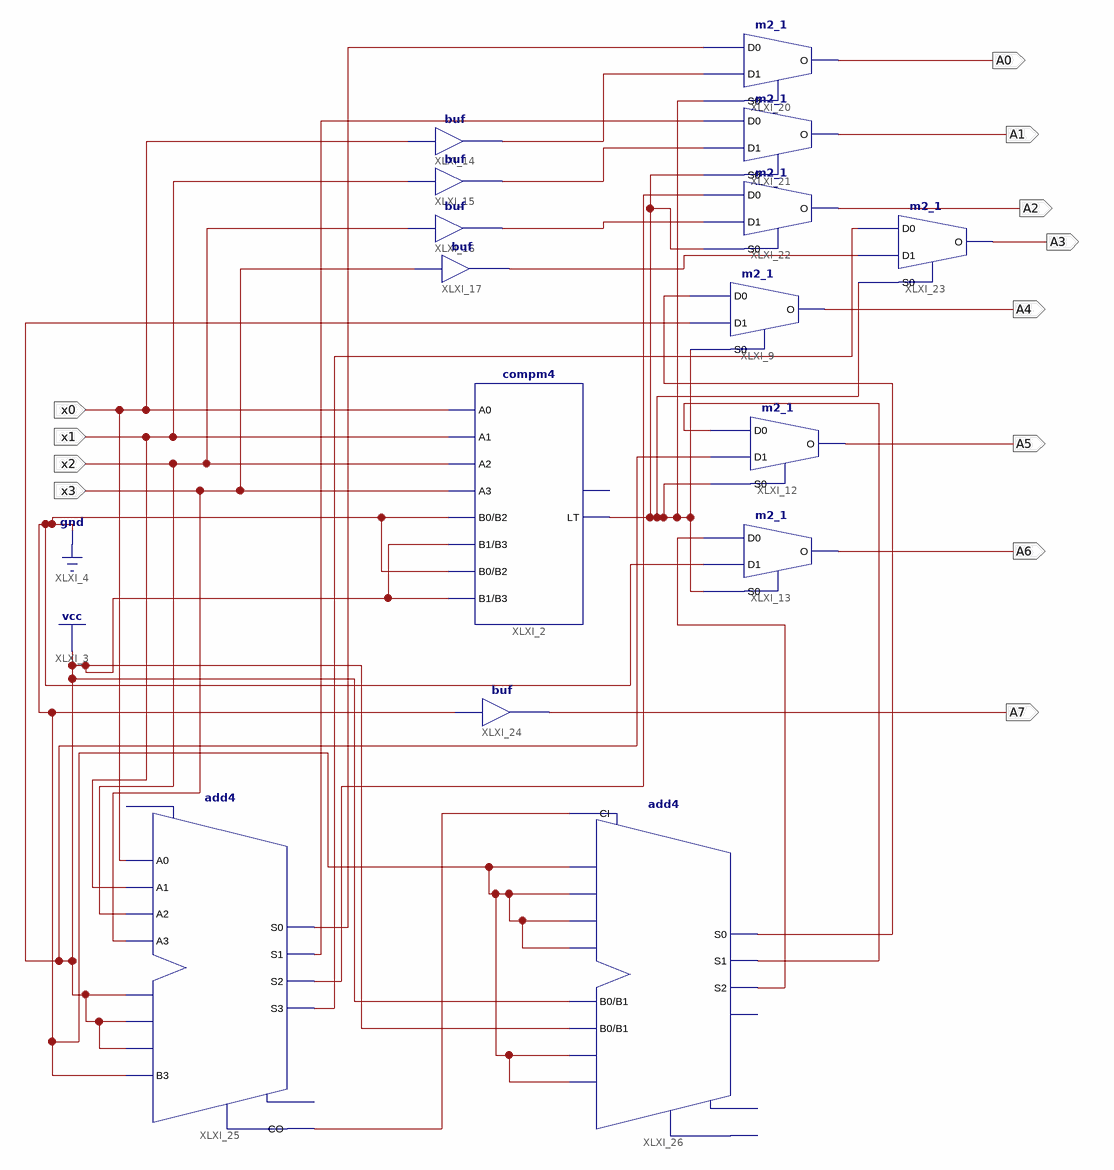
[diagram p0: schematic sheet 1]
// Xilinx ISE schematic hex_ascii_schem.sch (artix7) as structural Verilog: 15 symbols, 12 ports
module hex_ascii_schem (
  input  x3,
  input  x1,
  input  x2,
  input  x0,
  output A4,
  output A5,
  output A6,
  output A0,
  output A1,
  output A2,
  output A3,
  output A7
);

  wire XLXN_65, XLXN_66, XLXN_67, XLXN_68, XLXN_72, XLXN_84, XLXN_85, XLXN_86, XLXN_87, XLXN_88, XLXN_94,
       XLXN_95, XLXN_96;

  compm4 XLXI_2 (
    .A0(x0), .A1(x1), .A2(x2), .A3(x3), .B0(1'b0), .B1(1'b1), .B2(1'b0), .B3(1'b1), .LT(XLXN_65));  // open: GT
  m2_1 XLXI_9 (.D0(XLXN_94), .D1(1'b1), .S0(XLXN_65), .O(A4));
  m2_1 XLXI_12 (.D0(XLXN_95), .D1(1'b1), .S0(XLXN_65), .O(A5));
  m2_1 XLXI_13 (.D0(XLXN_96), .D1(1'b0), .S0(XLXN_65), .O(A6));
  buf XLXI_14 (XLXN_66, x0);
  buf XLXI_15 (XLXN_67, x1);
  buf XLXI_16 (XLXN_68, x2);
  buf XLXI_17 (XLXN_72, x3);
  m2_1 XLXI_20 (.D0(XLXN_84), .D1(XLXN_66), .S0(XLXN_65), .O(A0));
  m2_1 XLXI_21 (.D0(XLXN_85), .D1(XLXN_67), .S0(XLXN_65), .O(A1));
  m2_1 XLXI_22 (.D0(XLXN_86), .D1(XLXN_68), .S0(XLXN_65), .O(A2));
  m2_1 XLXI_23 (.D0(XLXN_87), .D1(XLXN_72), .S0(XLXN_65), .O(A3));
  buf XLXI_24 (A7, 1'b0);
  add4 XLXI_25 (
    .A0(x0), .A1(x1), .A2(x2), .A3(x3), .B0(1'b1), .B1(1'b1), .B2(1'b1), .B3(1'b0), .CO(XLXN_88),
    .S0(XLXN_84), .S1(XLXN_85), .S2(XLXN_86), .S3(XLXN_87));  // open: CI, OFL
  add4 XLXI_26 (
    .A0(1'b0), .A1(1'b0), .A2(1'b0), .A3(1'b0), .B0(1'b1), .B1(1'b1), .B2(1'b0), .B3(1'b0), .CI(XLXN_88),
    .S0(XLXN_94), .S1(XLXN_95), .S2(XLXN_96));  // open: CO, OFL, S3
endmodule
